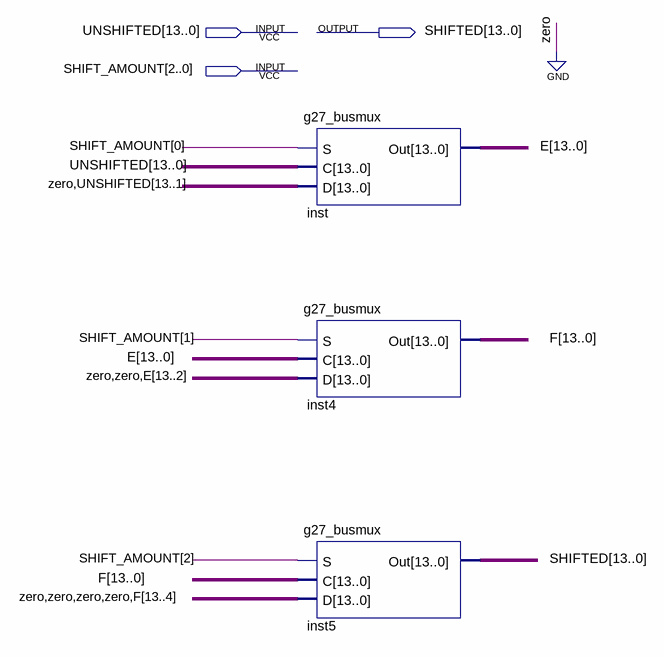
[diagram p0: schematic sheet]
// Quartus schematic g27_Barrel_Shifter.bdf as structural Verilog: 3 symbols, 3 pins
module g27_Barrel_Shifter (
  input  [13:0] UNSHIFTED,
  input  [2:0] SHIFT_AMOUNT,
  output [13:0] SHIFTED
);

  wire [13:0] E, F;

  g27_busmux inst (.S(SHIFT_AMOUNT[0]), .C(UNSHIFTED), .D({1'b0, UNSHIFTED[13:1]}), .Out(E));
  g27_busmux inst4 (.S(SHIFT_AMOUNT[1]), .C(E), .D({2'b00, E[13:2]}), .Out(F));
  g27_busmux inst5 (.S(SHIFT_AMOUNT[2]), .C(F), .D({4'b0000, F[13:4]}), .Out(SHIFTED));
endmodule
